# EasyEDA Pro project ProPrj_电源板_2025-12-14-16-16-23.epro

# Schematic Schematic1
Board Name: Board1; Create Date: 2025-12-14; Page Name: P1; Project Name: 电源板; Schematic Name: Schematic1; Update Date: 2025-12-14; Company: 嘉立创EDA; Page Size: A4; Version: V1.0
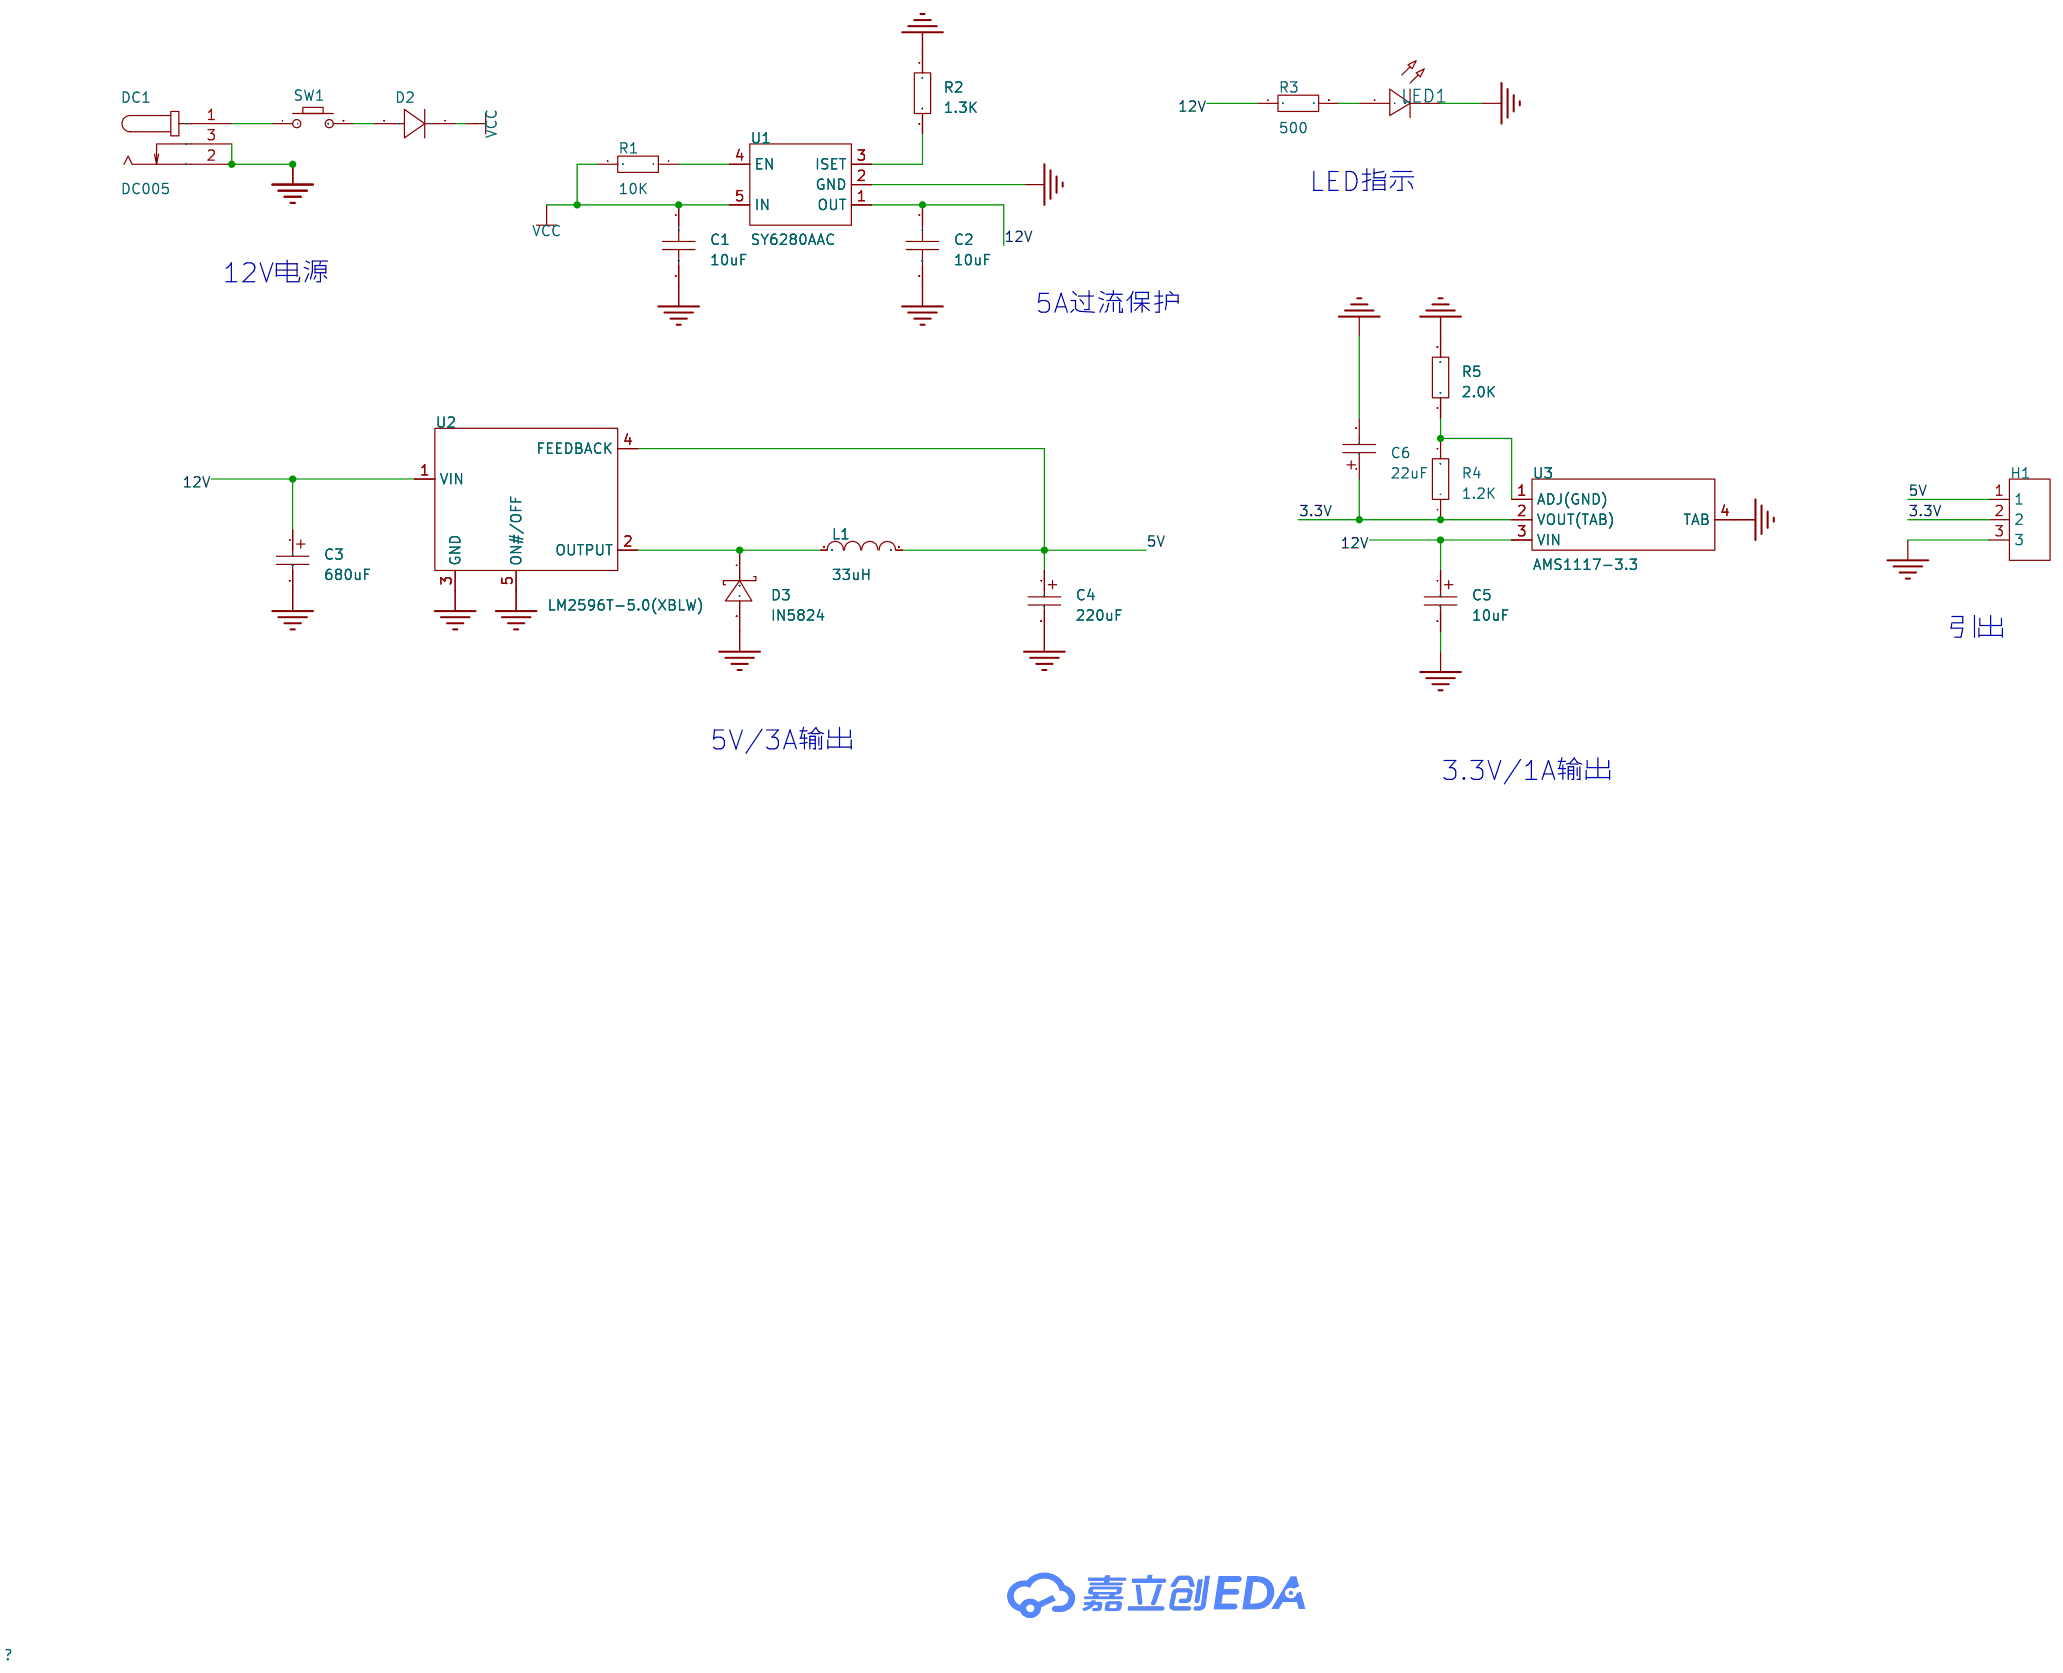
[diagram p0: schematic sheet]

## Parts
C1  10uF  [C0603]
C2  10uF  [C0603]
C3  680uF  [C_Ele_SMD_3x5.4mm]
C4  220uF  [C_Ele_SMD_3x5.4mm]
C5  10uF  [C_Ele_SMD_3x5.4mm]
C6  22uF  [C_Ele_SMD_3x5.4mm]
D2  -  [DO_1N4007]
D3  IN5824  [SMAF_L3.5-W2.6-LS4.7-RD]
DC1  DC005  [DC-IN-TH_DC005]
H1  -  [HDR-TH_3P-P2.54-V-F]
L1  33uH  [L0603]
LED1  -  [LED_0603]
R1  10K  [R0805]
R2  1.3K  [R0805]
R3  500  [R0805]
R4  1.2K  [R0805]
R5  2.0K  [R0805]
SW1  -  [Key_TH_3.5x6x4.3]
U1  SY6280AAC  [SOT-23-5_L3.0-W1.7-P0.95-LS2.8-BR]
U2  LM2596T-5.0(XBLW)  [TO-220-5L_L10.2-W4.5-P1.71-L]
U3  AMS1117-3.3  [SOT-223-4_L6.5-W3.5-P2.30-LS7.0-BR]

## Library data of the parts
C1 C2 = CAP_0603: Supplier Footprint: 0603
C3-C6 = C_Ele_SMD_3x5.4mm: Supplier Footprint: SMD,3x5.4mm
D2 = D_1N4007A: Supplier Footprint: DO-41
D3 = IN5824: Supplier Part: C9900003970; Supplier Footprint: D1206a; JLCPCB Part Class: 扩展库; Supplier: LCSC
DC1 = DC005: 连接器类型:DC电源插座;安装方式:弯插;触点内径:2mm;触点外径:6.3mm;额定电流:500mA;额定电压:12V;工作温度:-30℃~+70℃;; LCSC Part Name: DC电源插座 内径:2mm 外径:6.3mm; Supplier Part: C431533; Manufacturer: SHOU HAN(首韩); Supplier Footprint: 插件; JLCPCB Part Class: 扩展库; Datasheet: https://item.szlcsc.com/datasheet/DC005/427890.html; Supplier: LCSC; Connector Type: DC电源插座; Mounting Type: 弯插; Inside Contact Diameter: 2mm; Outside Contact Diameter: 6.3mm; Current Rating: 500mA; Voltage Rating (Max): 12V; Operating Temperature: -30℃~+70℃
H1 = HDR-F_2.54_1x3P: Supplier Part: C541850; Supplier Footprint: 插件
L1 = L_0603
LED1 = LED_0603-R: Supplier Footprint: 0603
R1-R5 = Res_0805: Supplier Footprint: 0805
SW1 = Key_TH_3.5x6x4.3: Supplier Footprint: 插件
U1 = SY6280AAC: Supplier Part: C9900003867; Supplier Footprint: SOT-23-5; JLCPCB Part Class: 扩展库; Supplier: LCSC
U2 = LM2596T-5.0(XBLW): 功能类型:降压型;工作电压:6V~40V;输出电压:5V;输出电流:3A;输出类型:固定;; Supplier Part: C41361394; Manufacturer: XBLW(芯伯乐); Supplier Footprint: TO-220-5L; JLCPCB Part Class: 扩展库; Datasheet: https://item.szlcsc.com/datasheet/LM2596T-5.0(XBLW)/43105603.html; Supplier: LCSC; Function: 降压型; Voltage - Supply: 6V~40V; Output Voltage: 5V; Output Current: 3A; Frequency - Switching: 150kHz; Operating Temperature: -40℃~+125℃; Synchronous Rectifier: 否; Number of Outputs: 1; Topology: 降压式; Quiescent Current: 5mA; Switch tube (built-in/external): 内置; Output Type: 固定
U3 = AMS1117-3.3_C347222: 输出类型:固定;工作电压:12V;输出电压:3.3V;输出电流:1A;电源纹波抑制比(PSRR):60dB@(120Hz);输出极性:正极;; LCSC Part Name: 输出:3.3V 电流:1A 耐压:12V; Supplier Part: C347222; Manufacturer: UMW(友台半导体); Supplier Footprint: SOT-223; JLCPCB Part Class: 扩展库; Datasheet: https://item.szlcsc.com/datasheet/AMS1117-3.3/323882.html; Supplier: LCSC; Output Type: 固定; Voltage - Supply: 12V; Output Voltage: 3.3V; Output Current: 1A; Power Supply Rejection Ratio (PSRR): 60dB@(120Hz); Voltage Dropout: 1.3V@(1A); standby current: 5mA; Noise: 0.003%Vout; Features: 过流保护; Operating Temperature: -40℃~+125℃; Output Configuration: 正极; Number of Outputs: 1

## Nets
3.3V: C6.1 H1.2 R4.1 U3.2(VOUT(TAB))
5V: C4.1 H1.1 L1.2 U2.4(FEEDBACK)
12V: C2.1 C3.1 C5.1 R3.1 U1.1(OUT) U2.1(VIN) U3.3(VIN)
GND: C1.2 C2.2 C3.2 C4.2 C5.2 C6.2 D3.2(A) DC1.2 DC1.3 H1.3 LED1.1(C) R2.1 R5.2 U1.2(GND) U2.3(GND) U2.5(ON#/OFF) U3.4(TAB)
VCC: C1.1 D2.1(K) R1.2 U1.5(IN)
$1N261: DC1.1 SW1.A
$1N393: D2.2(A) SW1.B
$1N669: R1.1 U1.4(EN)
$1N1259: R2.2 U1.3(ISET)
$1N1376: LED1.2(A) R3.2
$1N1972: D3.1(C) L1.1 U2.2(OUTPUT)
$1N2312: R4.2 R5.1 U3.1(ADJ(GND))

## Notes on the sheet
- LED指示
- 12V电源
- 5A过流保护
- 引出
- 5V/3A输出
- 3.3V/1A输出

# Board PCB1
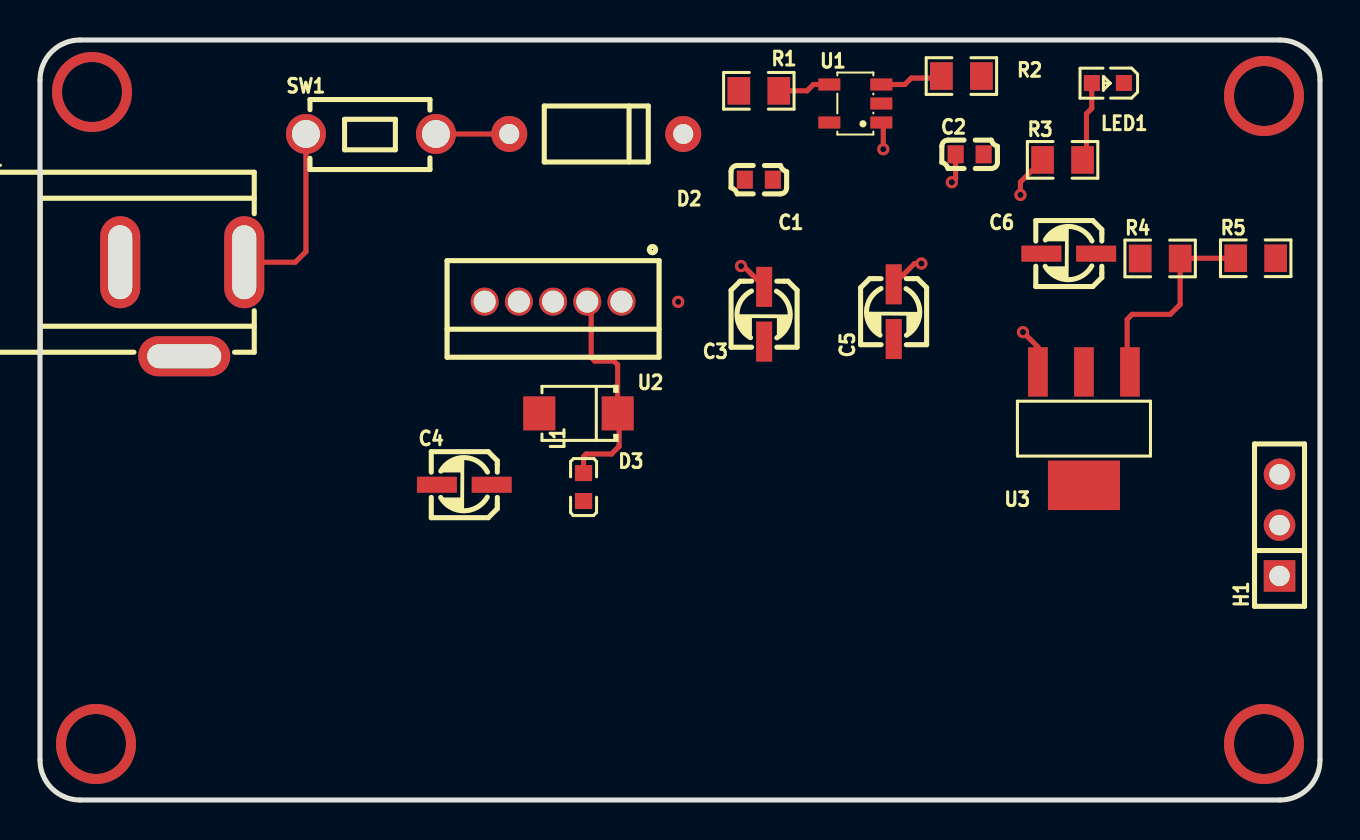
[diagram p1: board, top side]
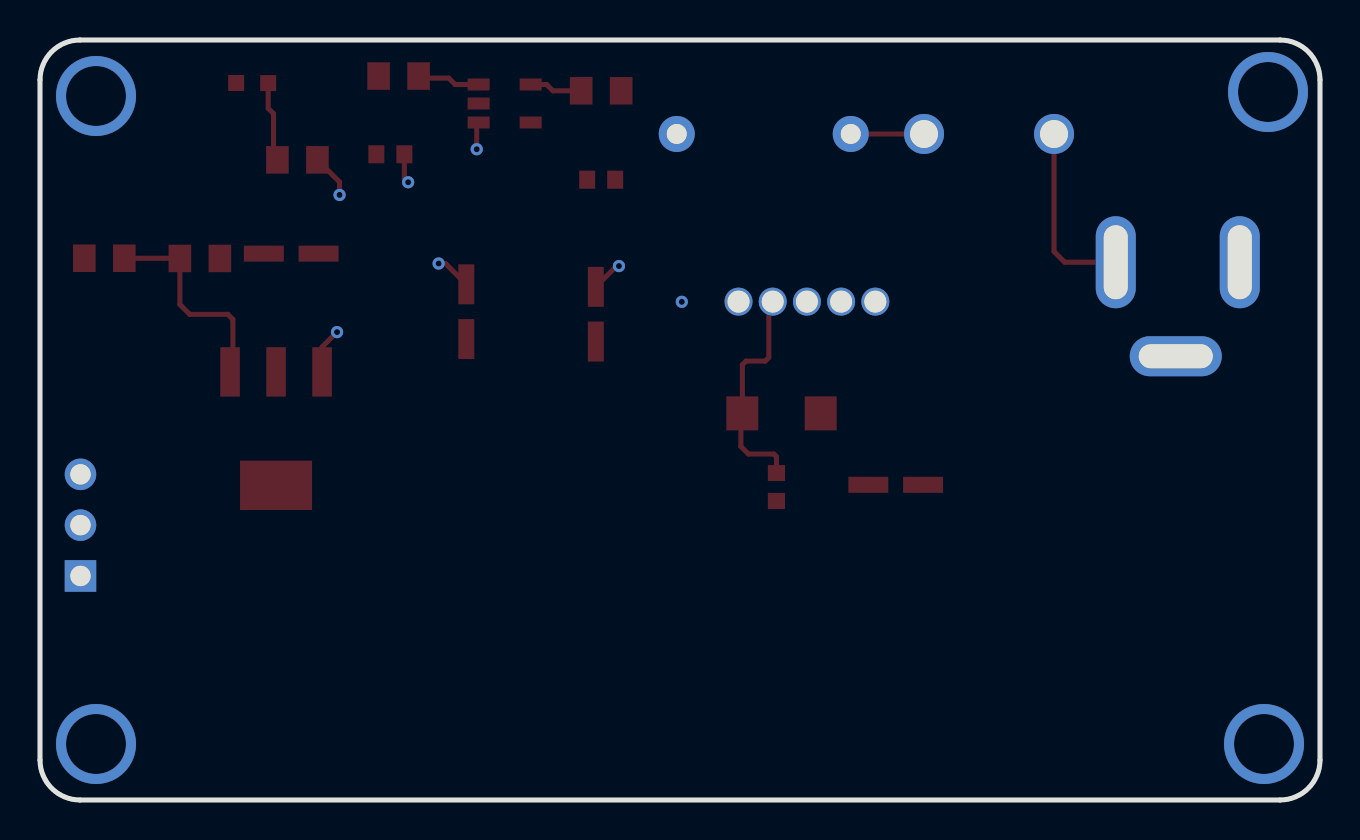
[diagram p2: board, bottom side, seen from below]

Outline 64 x 38 mm; copper layers: Top Layer, GND, PWR, Bottom Layer. Coordinates in mm from the lower left corner of the outline.
Outline path: 0,36 0,2 arc(0.59,0.59) 2,0 62,0 arc(63.41,0.59) 64,2 64,36 arc(63.41,37.41) 62,38 2,38 arc(0.59,37.41) 0,36
Stack: Top Layer 0.035mm 外层铜厚1oz / Dielectric1 0.2104mm 7628 RC49% 8.6mil / GND 0.0152mm 内层铜厚 / Dielectric2 1.065mm 1.1mm H/HOZ Copper / PWR 0.0152mm 内层铜厚 / Dielectric3 0.2104mm 7628 RC49% 8.6mil / Bottom Layer 0.035mm 外层铜厚1oz

## Design rules (mm)
template: JLCPCB Capability(Two Layers Board)
spacing copperThickness1oz (default): track to track 0.102, other pairs 0.152 to 0.3
spacing copperThickness2oz: track to track 0.203, other pairs 0.152 to 0.3
track width copperThickness1oz (default): min 0.127, default 0.254, max 2.54
track width copperThickness2oz: min 0.203, default 0.254, max 2.54
differential pair differentialPair (default): width min 0.127, default 0.254, max 2.54; gap min 0.152, default 0.152
via viaSize (default): diameter min 0.5, default 0.61, max 10; hole min 0.3, default 0.305, max 6.3

## Placement (name value [footprint] x y rotation side)
C1  10uF  [C0603]  35.94 31.02 0 top
C2  10uF  [C0603]  46.48 32.28 0 top
C3  680uF  [C_Ele_SMD_3x5.4mm]  36.19 24.28 90 top
C4  220uF  [C_Ele_SMD_3x5.4mm]  21.21 15.78 0 top
C5  10uF  [C_Ele_SMD_3x5.4mm]  42.67 24.41 90 top
C6  22uF  [C_Ele_SMD_3x5.4mm]  51.44 27.33 0 top
D2  -  [DO_1N4007]  27.81 33.3 180 top
D3  IN5824  [SMAF_L3.5-W2.6-LS4.7-RD]  26.92 19.33 180 top
DC1  DC005  [DC-IN-TH_DC005]  7.11 24.54 0 top
H1  -  [HDR-TH_3P-P2.54-V-F]  61.98 13.74 90 top
L1  33uH  [L0603]  27.18 15.65 270 top
LED1  -  [LED_0603]  53.34 35.84 180 top
R1  10K  [R0805]  35.94 35.46 180 top
R2  1.3K  [R0805]  46.07 36.2 180 top
R3  500  [R0805]  51.13 32.01 0 top
R4  1.2K  [R0805]  56.01 27.08 0 top
R5  2.0K  [R0805]  60.78 27.09 0 top
SW1  -  [Key_TH_3.5x6x4.3]  16.38 33.3 0 top
U1  SY6280AAC  [SOT-23-5_L3.0-W1.7-P0.95-LS2.8-BR]  40.77 34.83 0 top
U2  LM2596T-5.0(XBLW)  [TO-220-5L_L10.2-W4.5-P1.71-L]  25.65 24.92 180 top
U3  AMS1117-3.3  [SOT-223-4_L6.5-W3.5-P2.30-LS7.0-BR]  52.2 18.57 90 top

## Footprints (pads in the part's own frame, mm; a bottom-side part is the same pattern mirrored in y, then rotated)
C0603
  rect 0.8x0.9 smd: 1(-0.7,0) 2(0.7,0)
C_Ele_SMD_3x5.4mm
  rect 1.999x0.8 smd: 1(1.374,-0.014) 2(-1.364,-0.014)
DC-IN-TH_DC005
  oval 2x4.6 hole 1.2x3.7: 1(3.1,2.35) 2(-3.1,2.35)
  oval 4.6x2 hole 3.7x1.2: 3(0.1,-2.35)
DO_1N4007
  round 1.8 hole 1: 1(-4.35,0) 2(4.35,0)
HDR-TH_3P-P2.54-V-F
  rect 1.575x1.575 hole 1.02: 1(-2.54,0)
  round 1.575 hole 1.02: 2(0,0) 3(2.54,0)
Key_TH_3.5x6x4.3
  round 1.999 hole 1.399: A(-3.084,0) B(3.416,0)
L0603
  rect 0.8x0.864 smd: 1(-0.7,0) 2(0.7,0)
LED_0603
  rect 0.8x0.8 smd: 1(-0.851,-0.01) 2(0.75,-0.005)
R0805
  rect 1.133x1.377 smd: 1(-1,0) 2(1,0)
SMAF_L3.5-W2.6-LS4.7-RD
  rect 1.6x1.7 smd: 1(-1.96,0) 2(1.96,0)
SOT-23-5_L3.0-W1.7-P0.95-LS2.8-BR
  rect 1.1x0.6 smd: 1(1.3,-0.95) 2(1.3,0) 3(1.3,0.95) 4(-1.3,0.95) 5(-1.3,-0.95)
SOT-223-4_L6.5-W3.5-P2.30-LS7.0-BR
  rect 2.47x0.98 smd: 1(2.835,-2.3) 2(2.835,0) 3(2.835,2.3)
  rect 2.47x3.6 smd: 4(-2.835,0)
TO-220-5L_L10.2-W4.5-P1.71-L
  round 1.4 hole 1.1: 1(-3.42,0) 2(-1.71,0) 3(0,0) 4(1.71,0) 5(3.42,0)

## Nets
As in the schematic.

## Via types
v1: diameter 4, hole 3, Top Layer to Bottom Layer, 4 vias
v2: diameter 0.61, hole 0.305, Top Layer to Bottom Layer, 7 vias

## Routing (per net, layer and track width the routed paths; a pad name or vN(x,y) marks a point on that pad's centre or on a via; arc(x,y) is an arc through that point)
12V: length 13.6
  Top Layer w0.254: v2(49.15,23.39) 49.9,22.65 U3.3 ; v2(42.16,32.54) 42.16,33.78 U1.1 ; v2(49.02,30.25) 49.02,30.9 R3.1 ; v2(45.59,30.89) 45.78,31.08 C2.1 ; v2(35.05,26.7) 35.17,26.7 C3.1 ; C5.1 43.72,26.82 v2(44.07,26.82)
  PWR w0.254: v2(31.91,24.91) 31.9,24.92 U2.1
(no net):
  vias: v1(2.6,35.4) v1(2.8,2.8) v1(61.2,35.2) v1(61.2,2.8)
$1N261: length 9.2
  Top Layer w0.254: SW1.A 13.3,27.42 12.76,26.89 DC1.1
$1N393: length 3.7
  Top Layer w0.254: SW1.B D2.2
$1N669: length 2.7
  Top Layer w0.254: 39.47,35.78 38.67,35.78 38.35,35.46 R1.1
$1N1259: length 3.2
  Top Layer w0.254: U1.3 43.24,35.78 43.56,36.09 44.97,36.09 R2.2
$1N1376: length 4
  Top Layer w0.254: LED1.2 52.59,34.58 52.32,34.32 52.32,32.2 R3.2
$1N1972: length 11.3
  Top Layer w0.254: U2.2 27.56,24.72 27.56,22.12 27.74,21.95 28.7,21.95 28.88,21.77 28.88,19.33 D3.1 28.96,19.26 28.96,17.68 28.57,17.3 27.31,17.3 27.18,17.17 L1.1
$1N2312: length 10.7
  Top Layer w0.254: U3.1 54.36,21.55 54.36,24.03 54.61,24.28 56.51,24.28 57.01,24.78 R4.2 57.02,27.09 R5.1

## Copper pours and planes (outline as drawn; the poured copper is in the pictures)
12V on PWR: 28.32,26.19 28.32,23.39 28.45,23.27 33.53,23.27 34.55,24.29 44.85,24.29 44.98,24.42 49.66,19.75 49.66,19.46 50.8,19.46 51.05,19.71 51.05,23.14 46.48,27.71 46.48,29.11 49,29.11 51.13,31.24 51.13,33.1 50.55,33.68 49.15,33.68 48.39,32.92 48.39,30.76 46.61,30.76 46.48,30.63 46.48,33.52 46.2,33.8 43.57,33.8 42.8,34.32 42.56,34.33 41.23,34.33 39.24,32.34 39.24,29.24 37.53,27.52 28.32,27.52 28.32,26.19
